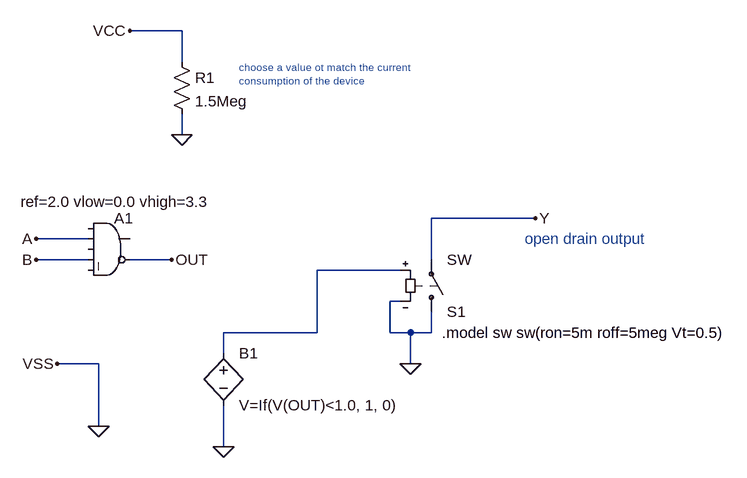
[diagram p0: schematic SN74LVC1G38.asc]
SN74LVC1G38.asc, the LTspice schematic file:
Version 4
SHEET 1 1164 680
WIRE 272 -176 192 -176
WIRE 272 -128 272 -176
WIRE 272 -16 272 -48
WIRE 816 112 656 112
WIRE 128 144 48 144
WIRE 128 176 48 176
WIRE 256 176 192 176
WIRE 656 176 656 112
WIRE 608 192 480 192
WIRE 608 240 592 240
WIRE 480 288 480 192
WIRE 480 288 336 288
WIRE 592 288 592 240
WIRE 624 288 592 288
WIRE 656 288 656 256
WIRE 656 288 624 288
WIRE 336 320 336 288
WIRE 144 336 80 336
WIRE 624 336 624 288
WIRE 144 432 144 336
WIRE 336 464 336 400
FLAG 48 144 A
FLAG 48 176 B
FLAG 624 336 0
FLAG 336 464 0
FLAG 192 -176 VCC
FLAG 272 -16 0
FLAG 80 336 VSS
FLAG 144 432 0
FLAG 816 112 Y
FLAG 256 176 OUT
SYMBOL Digital\\and 160 96 R0
WINDOW 39 -136 -9 Left 2
SYMATTR SpiceLine ref=2.0 vlow=0.0 vhigh=3.3
SYMATTR InstName A1
SYMBOL sw 656 272 M180
SYMATTR InstName S1
SYMBOL bv 336 304 R0
SYMATTR InstName B1
SYMATTR Value V=If(V(OUT)<1.0, 1, 0)
SYMBOL res 256 -144 R0
SYMATTR InstName R1
SYMATTR Value 1.5Meg
TEXT 672 288 Left 2 !.model sw sw(ron=5m roff=5meg Vt=0.5)
TEXT 800 144 Left 2 ;open drain output
TEXT 360 -120 Left 1 ;choose a value ot match the current\nconsumption of the device

The netlist it stands for:
* SN74LVC1G38.asc
A1 0 A 0 B 0 OUT 0 0 AND ref=2.0 vlow=0.0 vhigh=3.3
S1 0 Y N001 0 SW
B1 N001 0 V=If(V(OUT)<1.0, 1, 0)
R1 VCC 0 1.5Meg
.model sw sw(ron=5m roff=5meg Vt=0.5)
* open drain output
* choose a value ot match the current
* consumption of the device
.backanno
.end